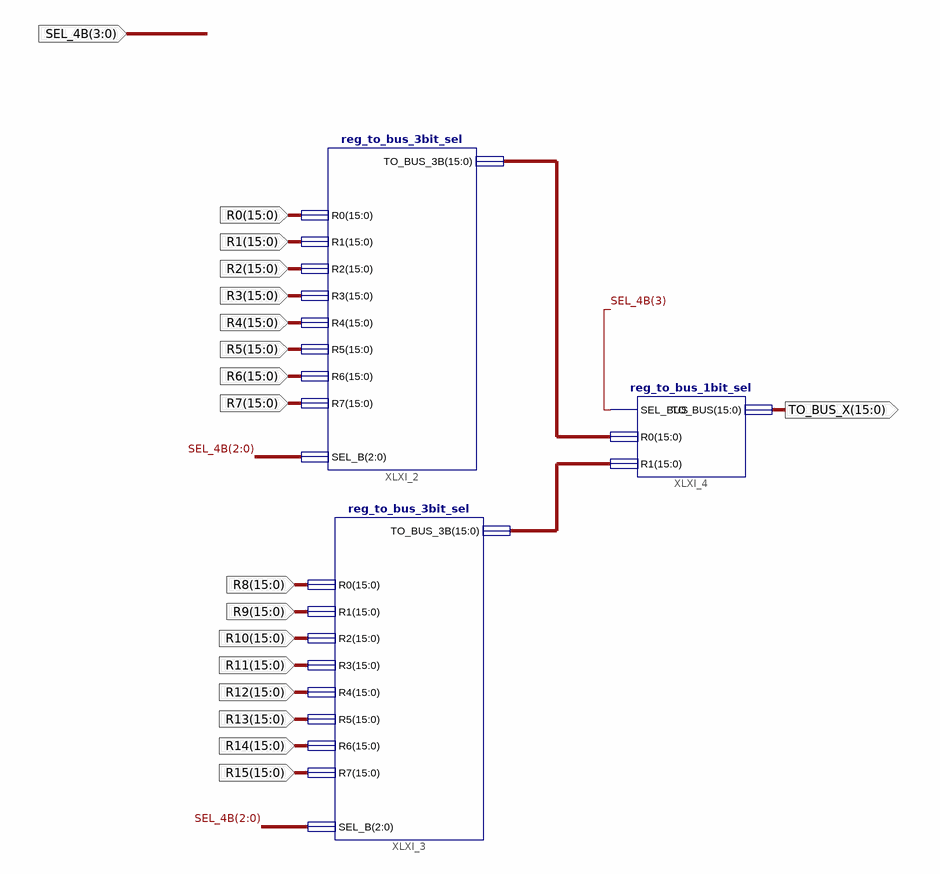
[diagram p0: schematic sheet 1]
// Xilinx ISE schematic reg_to_bus_4bit_sel.sch (artix7) as structural Verilog: 3 symbols, 18 ports
module reg_to_bus_4bit_sel (
  input  [3:0] SEL_4B,
  input  [15:0] R0,
  input  [15:0] R1,
  input  [15:0] R2,
  input  [15:0] R3,
  input  [15:0] R4,
  input  [15:0] R5,
  input  [15:0] R6,
  input  [15:0] R7,
  input  [15:0] R8,
  input  [15:0] R9,
  input  [15:0] R10,
  input  [15:0] R11,
  input  [15:0] R12,
  input  [15:0] R13,
  input  [15:0] R14,
  input  [15:0] R15,
  output [15:0] TO_BUS_X
);

  wire [15:0] XLXN_1, XLXN_2;

  reg_to_bus_3bit_sel XLXI_2 (
    .R0(R0), .R1(R1), .R2(R2), .R3(R3), .R4(R4), .R5(R5), .R6(R6), .R7(R7), .TO_BUS_3B(XLXN_1),
    .SEL_B(SEL_4B[2:0]));
  reg_to_bus_3bit_sel XLXI_3 (
    .R0(R8), .R1(R9), .R2(R10), .R3(R11), .R4(R12), .R5(R13), .R6(R14), .R7(R15), .TO_BUS_3B(XLXN_2),
    .SEL_B(SEL_4B[2:0]));
  reg_to_bus_1bit_sel XLXI_4 (.SEL_BUS(SEL_4B[3]), .R0(XLXN_1), .R1(XLXN_2), .TO_BUS(TO_BUS_X));
endmodule
